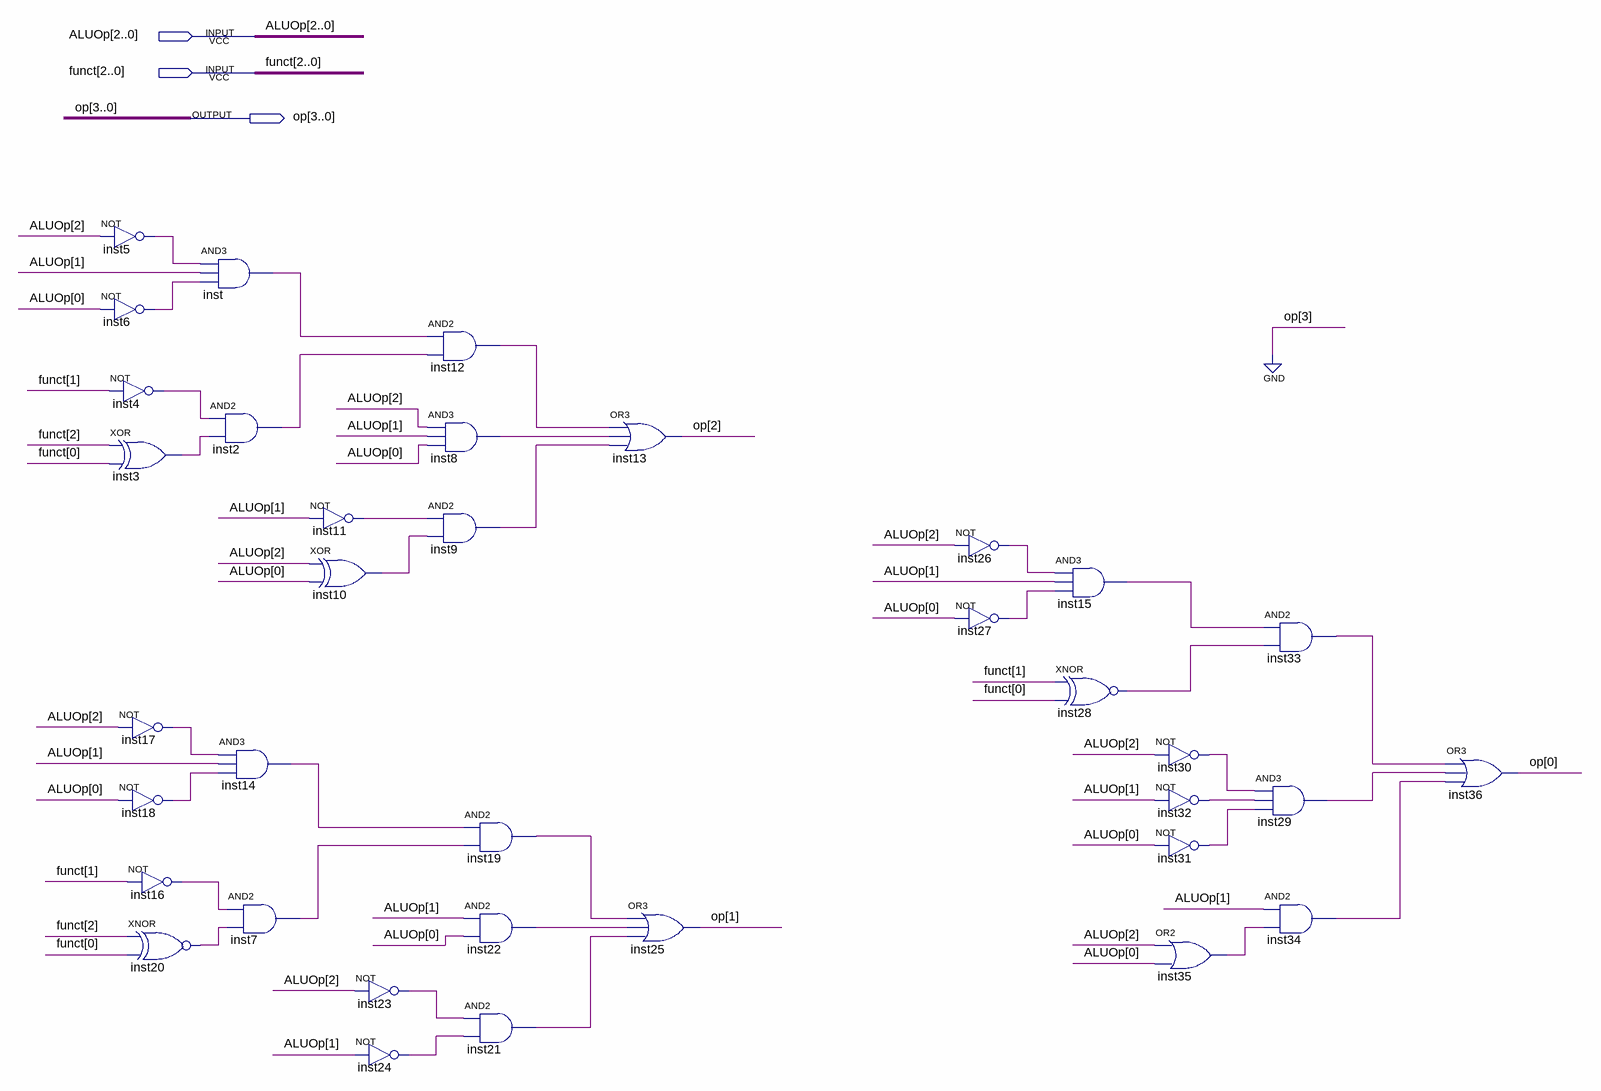
[diagram p0: schematic sheet]
// Quartus schematic ALUControl.bdf as structural Verilog: 36 symbols, 3 pins
module ALUControl (
  input  [2:0] ALUOp,
  input  [2:0] funct,
  output [3:0] op
);

  wire inst2_out, inst3_out, inst4_out, inst5_out, inst6_out, inst7_out, inst8_out, inst9_out, inst10_out,
       inst11_out, inst12_out, inst14_out, inst15_out, inst16_out, inst17_out, inst18_out, inst19_out,
       inst20_out, inst21_out, inst22_out, inst23_out, inst24_out, inst26_out, inst27_out, inst28_out,
       inst29_out, inst30_out, inst31_out, inst32_out, inst33_out, inst34_out, inst35_out, inst_out;

  not inst5 (inst5_out, ALUOp[2]);
  not inst6 (inst6_out, ALUOp[0]);
  not inst4 (inst4_out, funct[1]);
  xor inst3 (inst3_out, funct[2], funct[0]);
  not inst17 (inst17_out, ALUOp[2]);
  not inst18 (inst18_out, ALUOp[0]);
  not inst16 (inst16_out, funct[1]);
  xnor inst20 (inst20_out, funct[2], funct[0]);
  and inst (inst_out, inst5_out, ALUOp[1], inst6_out);
  and inst2 (inst2_out, inst4_out, inst3_out);
  and inst14 (inst14_out, inst17_out, ALUOp[1], inst18_out);
  and inst7 (inst7_out, inst16_out, inst20_out);
  not inst11 (inst11_out, ALUOp[1]);
  xor inst10 (inst10_out, ALUOp[2], ALUOp[0]);
  not inst23 (inst23_out, ALUOp[2]);
  not inst24 (inst24_out, ALUOp[1]);
  and inst12 (inst12_out, inst_out, inst2_out);
  and inst8 (inst8_out, ALUOp[2], ALUOp[1], ALUOp[0]);
  and inst9 (inst9_out, inst11_out, inst10_out);
  and inst19 (inst19_out, inst14_out, inst7_out);
  and inst22 (inst22_out, ALUOp[1], ALUOp[0]);
  and inst21 (inst21_out, inst23_out, inst24_out);
  or inst13 (op[2], inst12_out, inst8_out, inst9_out);
  or inst25 (op[1], inst19_out, inst22_out, inst21_out);
  not inst26 (inst26_out, ALUOp[2]);
  not inst27 (inst27_out, ALUOp[0]);
  and inst15 (inst15_out, inst26_out, ALUOp[1], inst27_out);
  xnor inst28 (inst28_out, funct[1], funct[0]);
  not inst30 (inst30_out, ALUOp[2]);
  not inst32 (inst32_out, ALUOp[1]);
  not inst31 (inst31_out, ALUOp[0]);
  or inst35 (inst35_out, ALUOp[2], ALUOp[0]);
  and inst33 (inst33_out, inst15_out, inst28_out);
  and inst29 (inst29_out, inst30_out, inst32_out, inst31_out);
  and inst34 (inst34_out, ALUOp[1], inst35_out);
  or inst36 (op[0], inst33_out, inst29_out, inst34_out);

  assign op[3] = 1'b0;
endmodule
